# EAGLE design TeensyServoController (EAGLE 7.1.0)
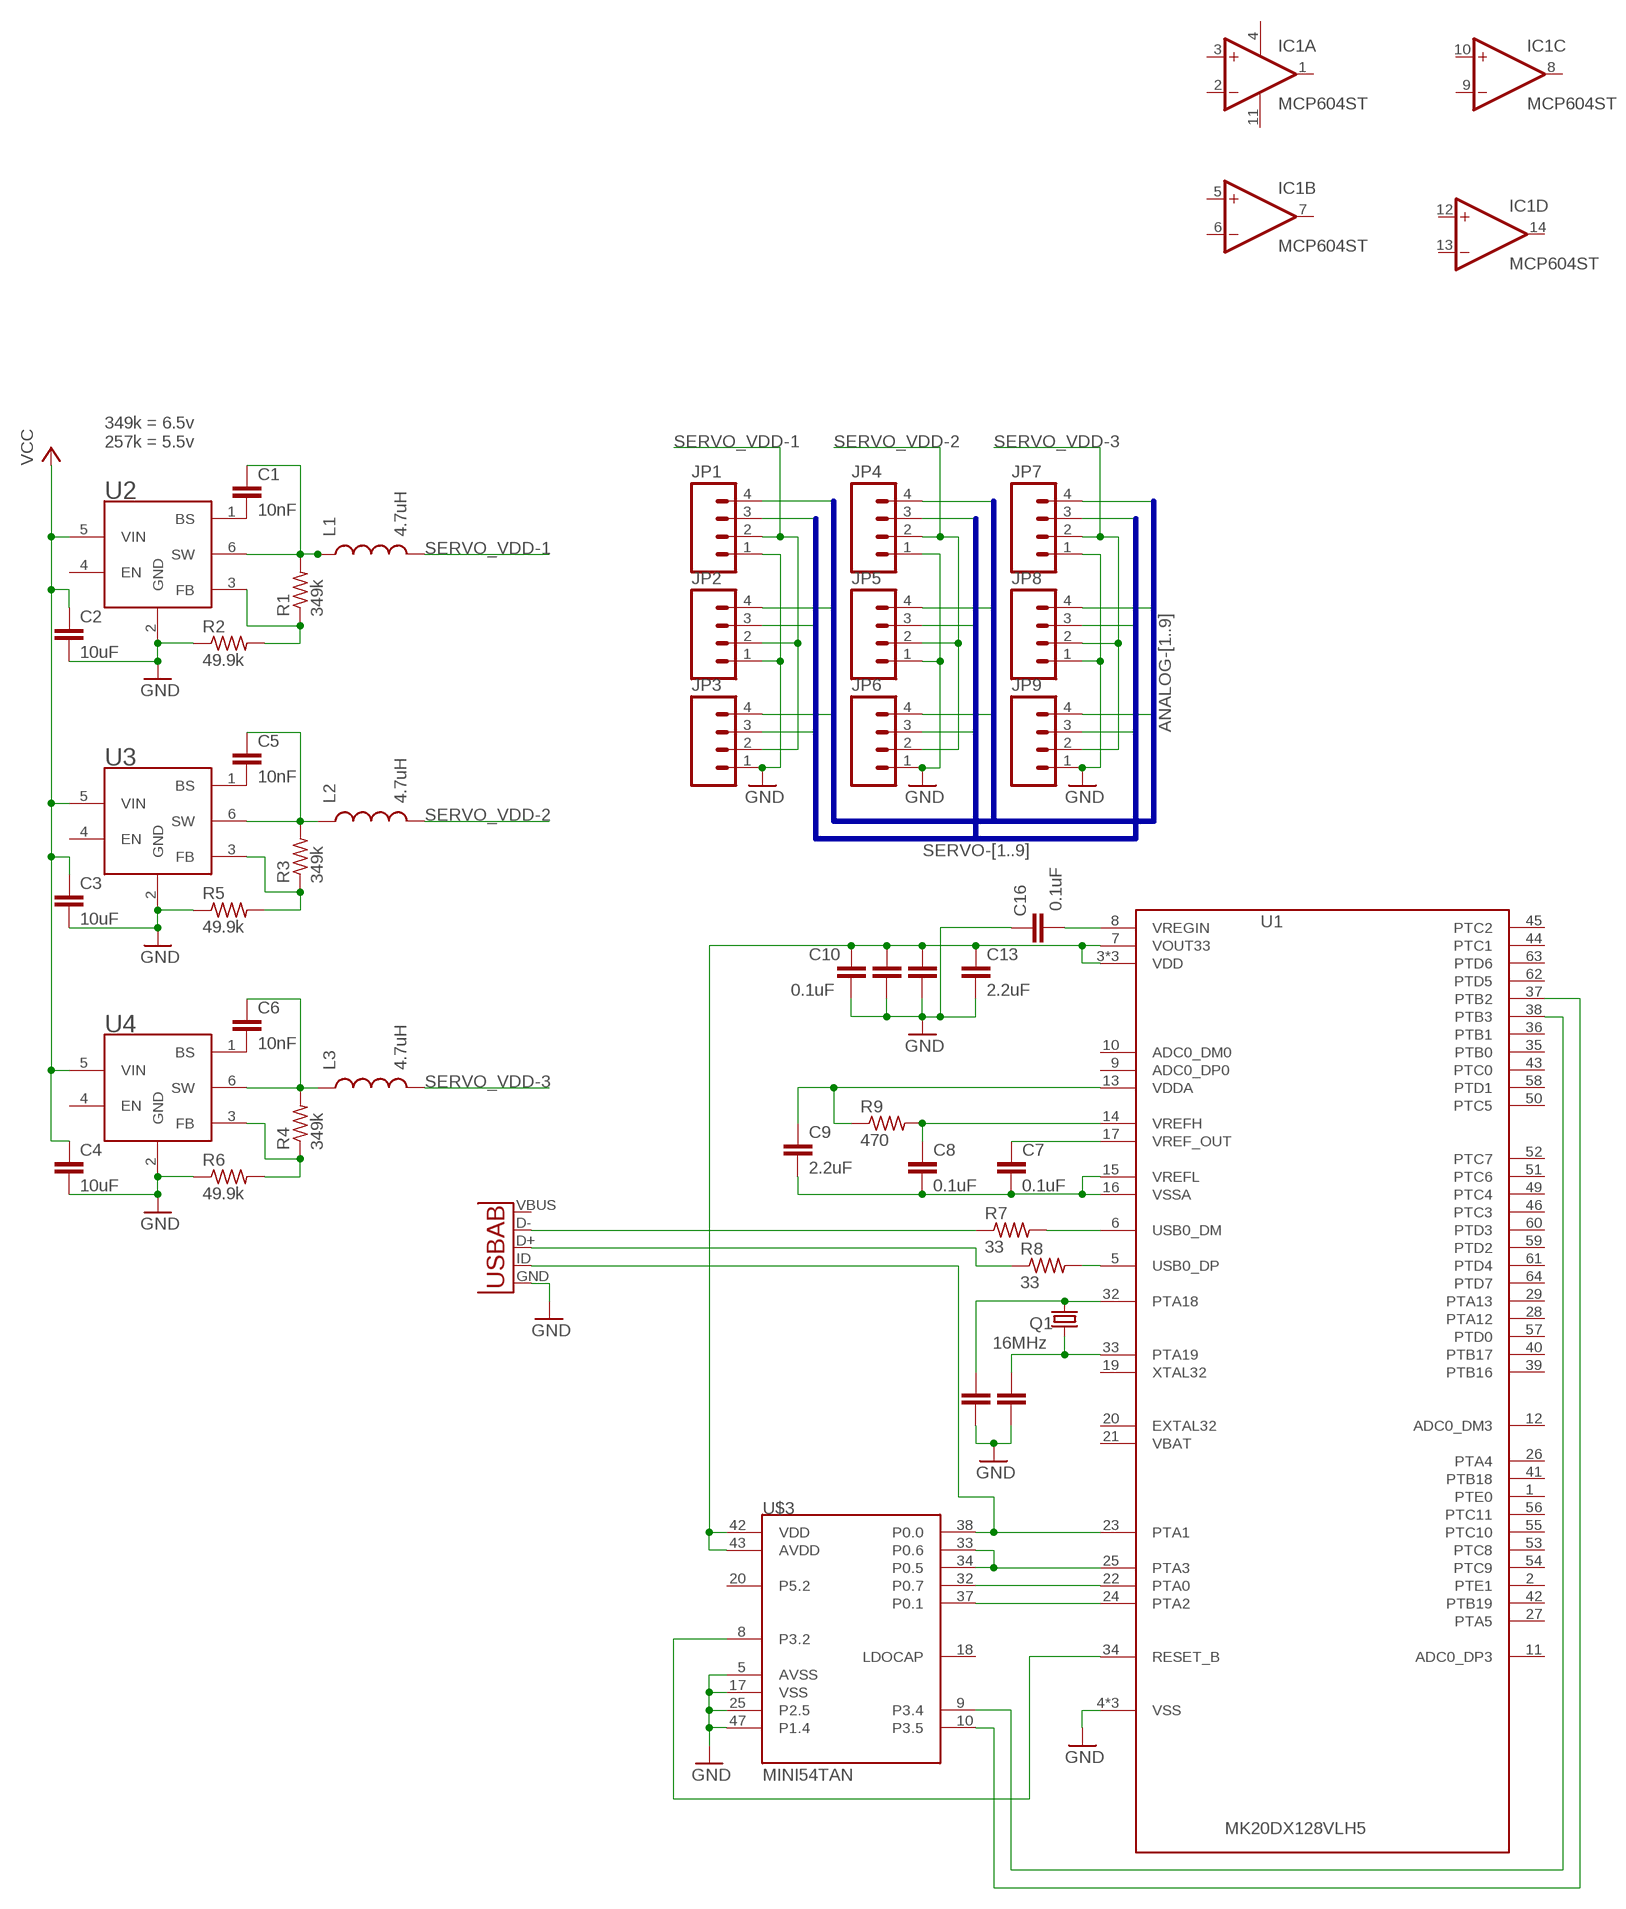
[diagram p0: schematic, sheet 1]

## Parts
C1  10nF  C-EUC0402  [C0402]
C2  10uF  C-EUC0805  [C0805]
C3  10uF  C-EUC0805  [C0805]
C4  10uF  C-EUC0805  [C0805]
C5  10nF  C-EUC0402  [C0402]
C6  10nF  C-EUC0402  [C0402]
C7  0.1uF  C-EUC0402  [C0402]
C8  0.1uF  C-EUC0402  [C0402]
C9  2.2uF  C-EUC0603  [C0603]
C10  0.1uF  C-EUC0402  [C0402]
C11  0.1uF  C-EUC0402  [C0402]
C12  0.1uF  C-EUC0402  [C0402]
C13  2.2uF  C-EUC0603  [C0603]
C14  0.1uF  C-EUC0402  [C0402]
C15  0.1uF  C-EUC0402  [C0402]
C16  0.1uF  C-EUC0402  [C0402]
IC1  MCP604ST  [TSSOP14]
JP1  M04LOCK  [1X04_LOCK]
JP2  M04LOCK  [1X04_LOCK]
JP3  M04LOCK  [1X04_LOCK]
JP4  M04LOCK  [1X04_LOCK]
JP5  M04LOCK  [1X04_LOCK]
JP6  M04LOCK  [1X04_LOCK]
JP7  M04LOCK  [1X04_LOCK]
JP8  M04LOCK  [1X04_LOCK]
JP9  M04LOCK  [1X04_LOCK]
L1  4.7uH  INDUCTORCR75  [CR75]
L2  4.7uH  INDUCTORCR75  [CR75]
L3  4.7uH  INDUCTORCR75  [CR75]
Q1  16MHz  CRYSTALCTS406  [CTS406]
R1  349k  R-US_R0402  [R0402]
R2  49.9k  R-US_R0402  [R0402]
R3  349k  R-US_R0402  [R0402]
R4  349k  R-US_R0402  [R0402]
R5  49.9k  R-US_R0402  [R0402]
R6  49.9k  R-US_R0402  [R0402]
R7  33  R-US_R0402  [R0402]
R8  33  R-US_R0402  [R0402]
R9  470  R-US_R0402  [R0402]
U1  MK20DX128VLH5  [MK20DX128VLH5]
U2  AP3211_SWITCHING_REGULATOR  [SOT-23-6]
U3  AP3211_SWITCHING_REGULATOR  [SOT-23-6]
U4  AP3211_SWITCHING_REGULATOR  [SOT-23-6]
U5  USB-AB  [USB-AB-MICRO-SMD]
U$3  MINI54TAN  [MINI54TAN]

## Nets
ANALOG-1: JP1.4
ANALOG-2: JP2.4
ANALOG-3: JP3.4
ANALOG-4: JP4.4
ANALOG-5: JP5.4
ANALOG-6: JP6.4
ANALOG-7: JP7.4
ANALOG-8: JP8.4
ANALOG-9: JP9.4
GND: C2.2 C3.2 C4.2 C10.2 C11.2 C12.2 C13.2 C14.2 C15.2 C16.1 JP1.1 JP2.1 JP3.1 JP4.1 JP5.1 JP6.1 JP7.1 JP8.1 JP9.1 R2.1 R5.1 R6.1 U1.4(VSS) U1.31(VSS) U1.47(VSS) U2.2(GND) U3.2(GND) U4.2(GND) U5.GND U$3.5(AVSS) U$3.17(VSS) U$3.25(P2.5) U$3.47(P1.4)
N$1: U1.23(PTA1) U5.ID(USBID) U$3.38(P0.0)
N$2: U1.25(PTA3) U$3.33(P0.6) U$3.34(P0.5)
N$3: U1.22(PTA0) U$3.32(P0.7)
N$4: U1.24(PTA2) U$3.37(P0.1)
N$5: U1.37(PTB2) U$3.10(P3.5)
N$6: R1.1 R2.2 U2.3(FB)
N$7: U1.38(PTB3) U$3.9(P3.4)
N$9: R8.1 U5.D+
N$10: R7.1 U5.D-
N$11: C5.1 L2.P$1 R3.2 U3.6(SW)
N$12: R7.2 U1.6(USB0_DM)
N$13: C1.1 L1.P$1 R1.2 U2.6(SW)
N$14: C1.2 U2.1(BS)
N$15: R8.2 U1.5(USB0_DP)
N$16: R4.1 R6.2 U4.3(FB)
N$17: C5.2 U3.1(BS)
N$18: R3.1 R5.2 U3.3(FB)
N$19: C6.2 U4.1(BS)
N$20: C6.1 L3.P$1 R4.2 U4.6(SW)
N$21: C14.1 Q1.3 U1.32(PTA18)
N$22: C15.1 Q1.1 U1.33(PTA19)
N$23: C16.2 U1.8(VREGIN)
N$24: C9.1 R9.1 U1.13(VDDA)
N$25: C7.2 C8.2 C9.2 U1.15(VREFL) U1.16(VSSA)
N$26: C7.1 U1.17(VREF_OUT)
N$27: C8.1 R9.2 U1.14(VREFH)
N$30: U1.34(RESET_B) U$3.8(P3.2)
N$31: C10.1 C11.1 C12.1 C13.1 U1.3(VDD) U1.7(VOUT33) U1.30(VDD) U1.48(VDD) U$3.42(VDD) U$3.43(AVDD)
SERVO-1: JP1.3
SERVO-2: JP2.3
SERVO-3: JP3.3
SERVO-4: JP4.3
SERVO-5: JP5.3
SERVO-6: JP6.3
SERVO-7: JP7.3
SERVO-8: JP8.3
SERVO-9: JP9.3
SERVO_VDD-1: JP1.2 JP2.2 JP3.2 L1.P$2
SERVO_VDD-2: JP4.2 JP5.2 JP6.2 L2.P$2
SERVO_VDD-3: JP7.2 JP8.2 JP9.2 L3.P$2
VCC: C2.1 C3.1 C4.1 U2.5(VIN) U3.5(VIN) U4.5(VIN)
Unconnected: IC1.1(A:OUT) IC1.2(A:-IN) IC1.3(A:+IN) IC1.5(B:+IN) IC1.6(B:-IN) IC1.7(B:OUT) IC1.8(C:OUT) IC1.9(C:-IN) IC1.10(C:+IN) IC1.12(D:+IN) IC1.13(D:-IN) IC1.14(D:OUT) U1.1(PTE0) U1.2(PTE1) U1.9(ADC0_DP0) U1.10(ADC0_DM0) U1.11(ADC0_DP3) U1.12(ADC0_DM3) U1.19(XTAL32) U1.20(EXTAL32) U1.21(VBAT) U1.26(PTA4) U1.27(PTA5) U1.28(PTA12) U1.29(PTA13) U1.35(PTB0) U1.36(PTB1) U1.39(PTB16) U1.40(PTB17) U1.41(PTB18) U1.42(PTB19) U1.43(PTC0) U1.44(PTC1) U1.45(PTC2) U1.46(PTC3) U1.49(PTC4) U1.50(PTC5) U1.51(PTC6) U1.52(PTC7) U1.53(PTC8) U1.54(PTC9) U1.55(PTC10) U1.56(PTC11) U1.57(PTD0) U1.58(PTD1) U1.59(PTD2) U1.60(PTD3) U1.61(PTD4) U1.62(PTD5) U1.63(PTD6) U1.64(PTD7) U2.4(EN) U3.4(EN) U4.4(EN) U5.VBUS U$3.18(LDOCAP) U$3.20(P5.2)

## Buses
SERVO-[1..9]
ANALOG-[1..9]

## Notes on the sheet
- 349k = 6.5v
  257k = 5.5v

## Power pins joined to a net without a drawn wire
V+: IC1.4(P:V+)
V-: IC1.11(P:V-)

## Library data of the parts
C1-C16 = resistor:C-EU: CAPACITOR, European symbol
IC1 = linear:MCP604: Quad Op Amp 2.7V to 6.0V Single Supply CMOS Source: http://ww1.microchip.com/downloads/en/DeviceDoc/21314g.pdf
JP1-JP9 = SparkFun-Connectors:M04: Header 4 Standard 4-pin 0.1" header. Use with straight break away headers (SKU : PRT-00116), right angle break away headers (PRT-00553), swiss pins (PRT-00743), machine pins (PRT-00117), and female headers (PRT-00115). Molex polarized connector foot print use with SKU : PRT-08231 with associated crimp pins and housings. 1MM SMD Version SKU: PRT-10208
L1-L3 = SparkFun-Passives:INDUCTOR: Inductors Basic Inductor/Choke - 0603 and 1206. Footprints are not proven and vary greatly between part numbers.
Q1 = crystal:CRYSTAL: CRYSTAL; OC_FARNELL: unknown; OC_NEWARK: unknown
R1-R9 = resistor:R-US_: RESISTOR, American symbol
U1 = TeensyCustom:MK20DX128VLH5: Teensy 3.0 Processing Unit - MK20DX128VLH5 ARM Cortex M0 Datasheet: http://cache.freescale.com/files/32bit/doc/data_sheet/K20P64M50SF0.pdf
U2-U4 = My Parts:AP3211_SWITCHING_REGULATOR
U5 = SparkFun-Connectors:USB-AB: This is a USB AB connector that is compatible with USB OTG. i.e. this connector can serve as a host or device
U$3 = TeensyCustom:MINI54TAN: MINI54TAN Bootloader from PJRC.com, preprogrammed with Teensy 3.0 bootloader. https://www.pjrc.com/store/ic_mini54_tqfp.html

## Board
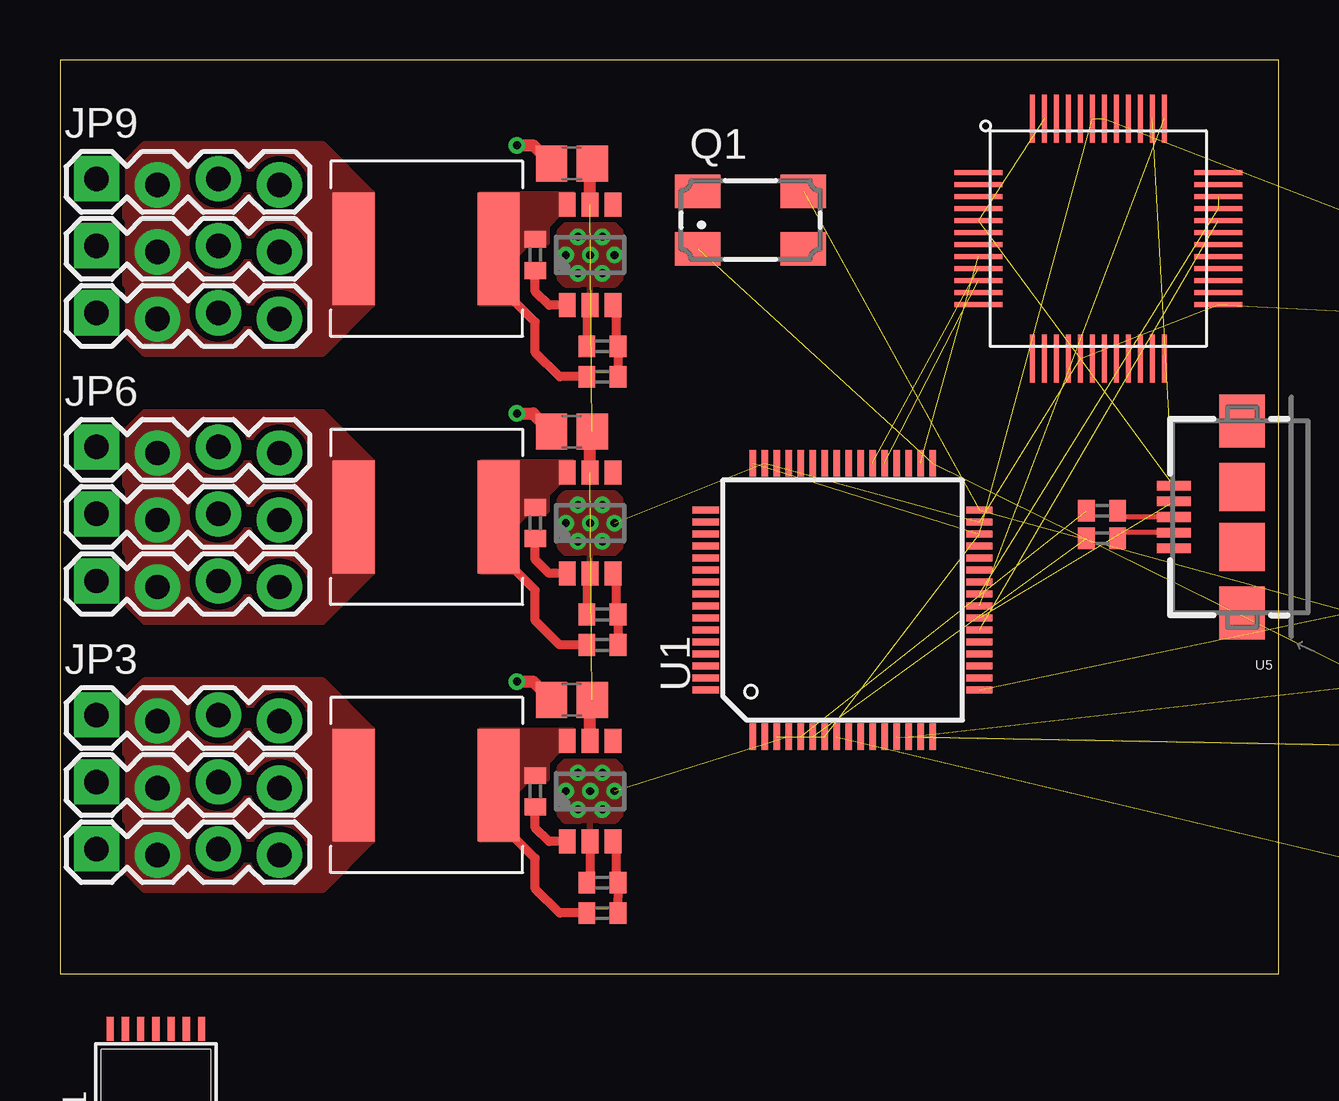
[diagram p1: board, top side]
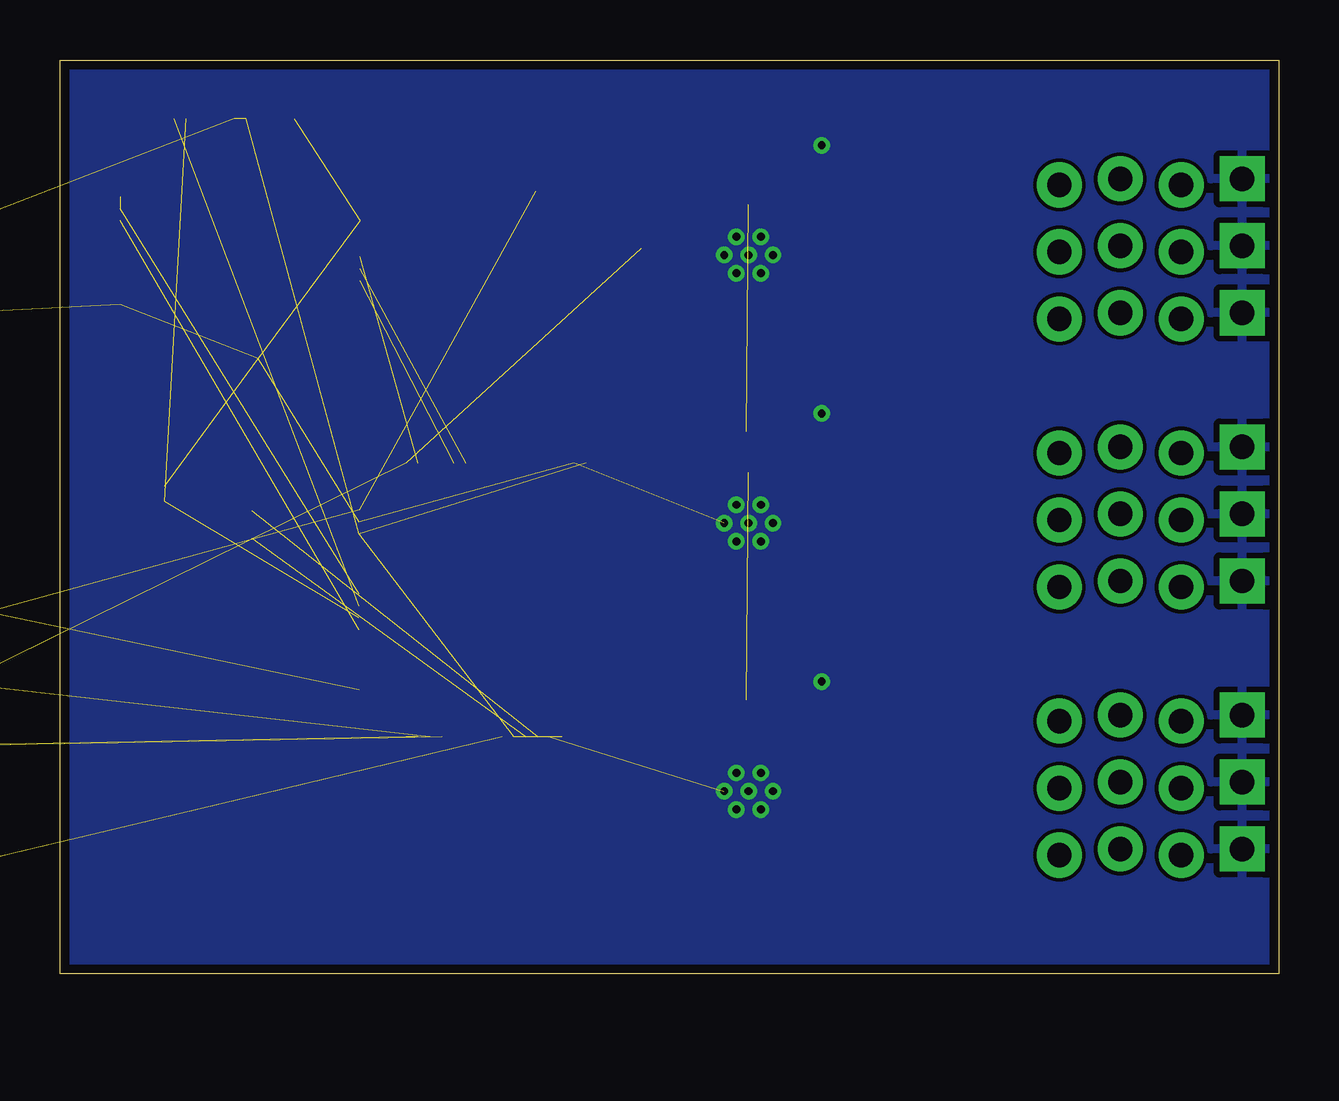
[diagram p2: board, bottom side, seen from below]

Size 50.8 x 38.1 mm. Coordinates in mm from the lower left corner, seen from the top.
Outline: 0,0 50.8,0 50.8,38.1 0,38.1 0,0
Copper layers (1*16): Top 0.0356mm / dielectric 1.5011mm / Bottom 0.0356mm
Design rules "OSHpark *": minimum track width 6mil, minimum drill 13mil, track to track 6mil, track to pad 6mil, pad to pad 6mil, via to via 6mil, smd to smd 6mil, copper to edge 15mil, drill to drill 6mil, minimum pad ring 7mil, minimum via ring 7mil, stop-mask expansion 3mil, vias tented up to drill 25mil, thermal gap 10mil

### Footprints (pad centres in the part's own frame; a part is rotated, then mirrored left to right if it is on the bottom)
C0402 = smd 0.7 x 0.9: 1 -0.65,0; 2 0.65,0
C0805 = smd 1.3 x 1.5: 1 -0.85,0; 2 0.85,0
C0603 = smd 1.1 x 1: 1 -0.85,0; 2 0.85,0
TSSOP14 = smd 0.305 x 0.991: 1 -1.905,-2.718; 2 -1.27,-2.718; 3 -0.635,-2.718; 4 0,-2.718; 5 0.635,-2.718; 6 1.27,-2.718; 7 1.905,-2.718; 8 1.905,2.718; 9 1.27,2.718; 10 0.635,2.718; 11 0,2.718; 12 -0.635,2.718; 13 -1.27,2.718; 14 -1.905,2.718
1X04_LOCK = drill 1.016 pad 1.88 square: 1 0,0.127 | drill 1.016 pad 1.88: 2 2.54,-0.127; 3 5.08,0.127; 4 7.62,-0.127
CR75 = smd 1.75 x 4.7: P$1 0,0; P$2 6.05,0
CTS406 = smd 1.9 x 1.4: 1 -2.2,-1.2; 2 2.2,-1.2; 3 2.2,1.2; 4 -2.2,1.2
R0402 = smd 0.7 x 0.9: 1 -0.65,0; 2 0.65,0
MK20DX128VLH5 = smd 1.1 x 0.285: 1 -5.605,3.385; 2 -5.605,2.885; 3 -5.605,2.385; 4 -5.605,1.885; 5 -5.605,1.385; 6 -5.605,0.885; 7 -5.605,0.385; 8 -5.605,-0.115; 9 -5.605,-0.615; 10 -5.605,-1.115; 11 -5.605,-1.615; 12 -5.605,-2.115; 13 -5.605,-2.615; 14 -5.605,-3.115; 15 -5.605,-3.615; 16 -5.605,-4.115; 33 5.795,-4.115; 34 5.795,-3.615; 35 5.795,-3.115; 36 5.795,-2.615; 37 5.795,-2.115; 38 5.795,-1.615; 39 5.795,-1.115; 40 5.795,-0.615; 41 5.795,-0.115; 42 5.795,0.385; 43 5.795,0.885; 44 5.795,1.385; 45 5.795,1.885; 46 5.795,2.385; 47 5.795,2.885; 48 5.795,3.385 | smd 0.285 x 1.1: 17 -3.655,-6.065; 18 -3.155,-6.065; 19 -2.655,-6.065; 20 -2.155,-6.065; 21 -1.655,-6.065; 22 -1.155,-6.065; 23 -0.655,-6.065; 24 -0.155,-6.065; 25 0.345,-6.065; 26 0.845,-6.065; 27 1.345,-6.065; 28 1.845,-6.065; 29 2.345,-6.065; 30 2.845,-6.065; 31 3.345,-6.065; 32 3.845,-6.065; 49 3.845,5.335; 50 3.345,5.335; 51 2.845,5.335; 52 2.345,5.335; 53 1.845,5.335; 54 1.345,5.335; 55 0.845,5.335; 56 0.345,5.335; 57 -0.155,5.335; 58 -0.655,5.335; 59 -1.155,5.335; 60 -1.655,5.335; 61 -2.155,5.335; 62 -2.655,5.335; 63 -3.155,5.335; 64 -3.655,5.335
SOT-23-6 = smd 0.7 x 1: 1 -0.95,-2.1; 2 0,-2.1; 3 0.95,-2.1; 4 0.95,2.1; 5 0,2.1; 6 -0.95,2.1
USB-AB-MICRO-SMD = smd 1.4 x 0.4: D+ 2.85,0; D- 2.85,0.65; GND 2.85,-1.3; ID 2.85,-0.65; VBUS 2.85,1.3 | smd 1.9 x 2: P$6 0,1.25; P$7 0,-1.25 | smd 1.9 x 2.2: P$8 0,4; P$9 0,-4
MINI54TAN = smd 0.2 x 2: 1 -2.75,-5; 2 -2.25,-5; 3 -1.75,-5; 4 -1.25,-5; 5 -0.75,-5; 6 -0.25,-5; 7 0.25,-5; 8 0.75,-5; 9 1.25,-5; 10 1.75,-5; 11 2.25,-5; 12 2.75,-5; 25 2.75,5; 26 2.25,5; 27 1.75,5; 28 1.25,5; 29 0.75,5; 30 0.25,5; 31 -0.25,5; 32 -0.75,5; 33 -1.25,5; 34 -1.75,5; 35 -2.25,5; 36 -2.75,5 | smd 2 x 0.2: 13 5,-2.75; 14 5,-2.25; 15 5,-1.75; 16 5,-1.25; 17 5,-0.75; 18 5,-0.25; 19 5,0.25; 20 5,0.75; 21 5,1.25; 22 5,1.75; 23 5,2.25; 24 5,2.75; 37 -5,2.75; 38 -5,2.25; 39 -5,1.75; 40 -5,1.25; 41 -5,0.75; 42 -5,0.25; 43 -5,-0.25; 44 -5,-0.75; 45 -5,-1.25; 46 -5,-1.75; 47 -5,-2.25; 48 -5,-2.75

### Placement (x,y rotation side)
C1  19.81,7.62 270 top
C2  21.34,11.43 180 top
C3  21.34,22.61 180 top
C4  21.34,33.78 180 top
C5  19.81,18.8 270 top
C6  19.81,29.97 270 top
C7  74.02,19.17 0 top  (outside the outline)
C8  74.02,14.17 0 top  (outside the outline)
C9  74.02,9.17 0 top  (outside the outline)
C10  73.91,4.06 0 top  (outside the outline)
C11  66.8,26.92 0 top  (outside the outline)
C12  66.8,21.84 0 top  (outside the outline)
C13  66.8,16.76 0 top  (outside the outline)
C14  66.8,11.68 0 top  (outside the outline)
C15  66.8,6.6 0 top  (outside the outline)
C16  66.8,1.52 0 top  (outside the outline)
IC1  4,-5 0 top
JP1  1.52,5.08 0 top
JP2  1.52,7.87 0 top
JP3  1.52,10.67 0 top
JP4  1.52,16.26 0 top
JP5  1.52,19.05 0 top
JP6  1.52,21.84 0 top
JP7  1.52,27.43 0 top
JP8  1.52,30.23 0 top
JP9  1.52,33.02 0 top
L1  18.29,7.87 180 top
L2  18.29,19.05 180 top
L3  18.29,30.23 180 top
Q1  28.79,31.43 0 top
R1  22.61,2.54 180 top
R2  22.61,3.81 0 top
R3  22.61,13.72 180 top
R4  22.61,24.89 180 top
R5  22.61,14.99 0 top
R6  22.61,26.16 0 top
R7  43.43,18.16 180 top
R8  43.43,19.3 180 top
R9  74.02,24.17 0 top  (outside the outline)
U1  32.26,15.49 90 top
U2  22.1,7.62 0 top
U3  22.1,18.8 0 top
U4  22.1,29.97 0 top
U5  49.28,19.05 180 top
U$3  43.28,30.65 270 top

### Tracks (layer width: path | path; a pad name or v marks a point on that pad's centre or on a via)
GND  (via drill 0.33)  (15 unrouted)
  Top 0.381: U2.2 22.1,4.07 R2.1 | U4.2 22.1,27.75 21.97,27.62 21.97,26.18 R6.1 | U3.2 22.1,16.51 21.97,16.38 R5.1
  Top 0.508: 20.49,33.87 C4.2 19.72,34.54 v19.05,34.54 | v19.05,23.37 19.72,23.37 C3.2 | v19.05,12.19 19.72,12.19 C2.2
  other vias: 22.1,7.62 22.1,18.8 22.1,29.97 21.08,7.62 23.11,7.62 22.61,8.38 21.59,8.38 21.59,6.86 22.61,6.86 23.11,18.8 21.08,18.8 21.59,18.03 22.61,18.03 22.61,19.56 21.59,19.56 22.1,29.97 23.11,29.97 21.08,29.97 21.59,30.73 22.61,30.73 22.61,29.21 21.59,29.21
  pour Bottom: 0,38.1 0,0 50.8,0 50.8,38.1
  pour Top: 21.84,5.59 21.84,6.1 21.59,6.35 21.08,6.35 20.83,6.6 20.83,8.64 21.08,8.89 23.11,8.89 23.37,8.64 23.37,6.6 23.11,6.35 22.61,6.35 22.35,6.1 22.35,5.59
  pour Top: 21.84,16.76 21.84,17.27 21.59,17.53 21.08,17.53 20.83,17.78 20.83,19.81 21.08,20.07 23.11,20.07 23.37,19.81 23.37,17.78 23.11,17.53 22.61,17.53 22.35,17.27 22.35,16.76
  pour Top: 21.84,27.94 21.84,28.45 21.59,28.7 21.08,28.7 20.83,28.96 20.83,30.99 21.08,31.24 23.11,31.24 23.37,30.99 23.37,28.96 23.11,28.7 22.61,28.7 22.35,28.45 22.35,27.94
N$1  (2 unrouted)
N$2  (2 unrouted)
N$3  (1 unrouted)
N$4  (1 unrouted)
N$5  (1 unrouted)
N$6
  Top 0.381: U2.3 23.05,5.34 23.18,5.21 23.18,3.96 R2.2 23.24,2.54 R1.1
N$7  (1 unrouted)
N$9
  Top 0.203: U5.D+ 44.34,19.05 R8.1
N$10
  Top 0.203: U5.D- 44.32,18.4 R7.1
N$11
  Top 0.381: R3.2 20.83,13.72 19.81,14.73 19.81,16 18.29,17.53 L2.P$1
  pour Top (no thermals): 21.4,21.34 17.53,21.34 17.53,16.76 19.05,16.76 19.05,18.8 19.56,19.3 20.32,19.3 20.32,20 20.83,20.51 21.4,20.51
N$12  (1 unrouted)
N$13
  Top 0.381: 20.07,8.41 C1.1 | L1.P$1 18.29,6.35 19.81,4.83 19.81,3.56 20.83,2.54 R1.2
  pour Top (no thermals): 21.4,10.16 17.53,10.16 17.53,5.59 19.05,5.59 19.05,7.62 19.56,8.13 20.32,8.13 20.32,8.83 20.83,9.33 21.4,9.33
N$14
  Top 0.381: U2.1 20.39,5.52 19.81,6.1 C1.2
N$15  (1 unrouted)
N$16
  Top 0.381: U4.3 23.05,27.69 23.18,27.56 23.18,26.24 R6.2 R4.1
N$17
  Top 0.381: U3.1 20.39,16.7 19.81,17.27 C5.2
N$18
  Top 0.381: U3.3 23.05,16.51 23.18,16.38 23.18,15.06 R5.2 R3.1
N$19
  Top 0.381: U4.1 20.39,27.87 19.81,28.45 C6.2
N$20
  Top 0.381: R4.2 20.83,24.89 19.81,25.91 19.81,27.18 18.29,28.7 L3.P$1
  pour Top (no thermals): 21.4,32.51 17.53,32.51 17.53,27.94 19.05,27.94 19.05,29.97 19.56,30.48 20.32,30.48 20.32,31.18 20.83,31.69 21.4,31.69
N$21  (2 unrouted)
N$22  (2 unrouted)
N$23  (1 unrouted)
N$24  (2 unrouted)
N$25  (4 unrouted)
N$26  (1 unrouted)
N$27  (2 unrouted)
N$30  (1 unrouted)
N$31  (9 unrouted)
SERVO_VDD-1
  pour Top (isolate 0.254, no thermals): 12.95,5.59 10.92,3.56 3.56,3.56 2.79,4.32 2.79,11.43 3.56,12.19 10.92,12.19 12.95,10.16
SERVO_VDD-2
  pour Top (isolate 0.254, no thermals): 12.95,16.76 10.92,14.73 3.56,14.73 2.79,15.49 2.79,22.61 3.56,23.37 10.92,23.37 12.95,21.34
SERVO_VDD-3
  pour Top (isolate 0.254, no thermals): 12.95,27.94 10.92,25.91 3.56,25.91 2.79,26.67 2.79,33.78 3.56,34.54 10.92,34.54 12.95,32.51
VCC  (2 unrouted)
  Top 0.508: U2.5 22.1,11.34 C2.1 | U3.5 22.1,22.52 C3.1 | U4.5 22.1,33.69 C4.1